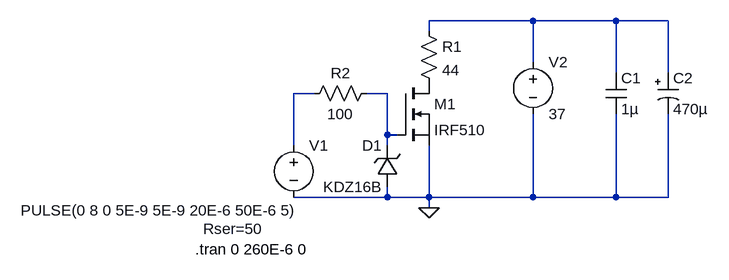
[diagram p0: schematic PulseCircuitwBypass_Zener_ResOnGate.asc]
PulseCircuitwBypass_Zener_ResOnGate.asc, the LTspice schematic file:
Version 4
SHEET 1 880 680
WIRE 384 -48 224 -48
WIRE 512 -48 384 -48
WIRE 592 -48 512 -48
WIRE 224 -32 224 -48
WIRE 384 16 384 -48
WIRE 512 32 512 -48
WIRE 592 32 592 -48
WIRE 48 64 16 64
WIRE 160 64 128 64
WIRE 160 128 160 64
WIRE 176 128 160 128
WIRE 16 144 16 64
WIRE 160 144 160 128
WIRE 160 224 160 208
WIRE 160 224 16 224
WIRE 224 224 224 144
WIRE 224 224 160 224
WIRE 384 224 384 96
WIRE 384 224 224 224
WIRE 512 224 512 96
WIRE 512 224 384 224
WIRE 592 224 592 96
WIRE 592 224 512 224
WIRE 224 240 224 224
FLAG 224 240 0
SYMBOL voltage 16 128 R0
WINDOW 123 0 0 Left 0
WINDOW 39 -139 145 Left 2
WINDOW 3 -420 116 Left 2
SYMATTR SpiceLine Rser=50
SYMATTR Value PULSE(0 8 0 5E-9 5E-9 20E-6 50E-6 5)
SYMATTR InstName V1
SYMBOL res 208 -48 R0
SYMATTR InstName R1
SYMATTR Value 44
SYMBOL voltage 384 0 R0
WINDOW 123 0 0 Left 0
WINDOW 39 0 0 Left 0
SYMATTR InstName V2
SYMATTR Value 37
SYMBOL nmos 176 48 R0
SYMATTR InstName M1
SYMATTR Value IRF510
SYMBOL cap 496 32 R0
SYMATTR InstName C1
SYMATTR Value 1µ
SYMATTR SpiceLine V=50 Irms=3.96 Rser=0.0234673 Lser=0 mfg="KEMET" pn="C1825C105K5RAC" type="X7R"
SYMBOL polcap 576 32 R0
WINDOW 3 24 56 Left 2
SYMATTR InstName C2
SYMATTR Value 470µ
SYMATTR Description Capacitor
SYMATTR Type cap
SYMATTR SpiceLine V=2 Irms=5.66947 Rser=0.007 Lser=0 mfg="KEMET" pn="A700X477M002ATE007" type="Al electrolytic"
SYMBOL res 144 48 R90
WINDOW 0 0 56 VBottom 2
WINDOW 3 32 56 VTop 2
SYMATTR InstName R2
SYMATTR Value 100
SYMBOL zener 176 208 R180
WINDOW 0 24 64 Left 2
WINDOW 3 24 0 Left 2
SYMATTR InstName D1
SYMATTR Value KDZ16B
SYMATTR Description Diode
SYMATTR Type diode
TEXT -136 304 Left 2 !.tran 0 260E-6 0

The netlist it stands for:
* PulseCircuitwBypass_Zener_ResOnGate.asc
V1 N002 0 PULSE(0 8 0 5E-9 5E-9 20E-6 50E-6 5) Rser=50
R1 N001 P001 44
V2 N001 0 37
M1 P001 N003 0 0 IRF510
C1 N001 0 1µ V=50 Irms=3.96 Rser=0.0234673 Lser=0 mfg="KEMET" pn="C1825C105K5RAC" type="X7R"
C2 N001 0 470µ V=2 Irms=5.66947 Rser=0.007 Lser=0 mfg="KEMET" pn="A700X477M002ATE007" type="Al electrolytic"
R2 N003 N002 100
D1 0 N003 KDZ16B
.model D D
.lib standard.dio
.model NMOS NMOS
.model PMOS PMOS
.lib standard.mos
.tran 0 260E-6 0
.backanno
.end